# Altium schematic sheet ICM-20948.SchDoc
size A4
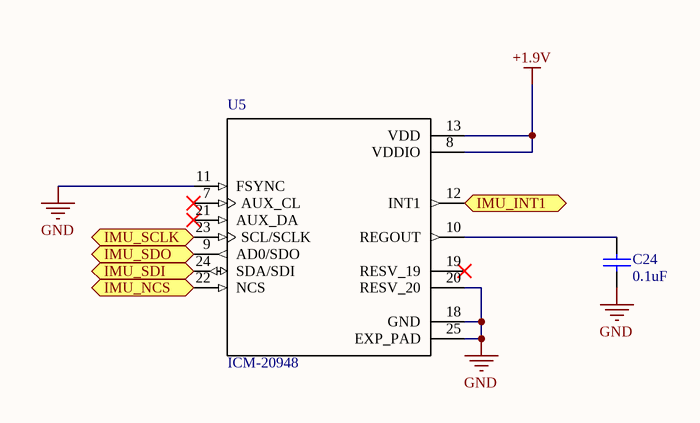
[diagram p0: ICM-20948.SchDoc]

## Parts
C24  value 0.1uF  [0201_Custom]
U5  ICM-20948  [ICM-20948]

## Ports
IMU_INT1 (out), IMU_NCS (in), IMU_SCLK (in), IMU_SDI (in), IMU_SDO (out)

## Nets
+1.9V: U5.8(VDDIO) U5.13(VDD)
GND: C24.2 U5.11(FSYNC) U5.18(GND) U5.20(RESV_20) U5.25(EXP_PAD)
IMU_INT1: U5.12(INT1) ; port IMU_INT1
IMU_NCS: U5.22(NCS) ; port IMU_NCS
IMU_SCLK: U5.23(SCL/SCLK) ; port IMU_SCLK
IMU_SDI: U5.24(SDA/SDI) ; port IMU_SDI
IMU_SDO: U5.9(AD0/SDO) ; port IMU_SDO
NetC24_1: C24.1 U5.10(REGOUT)

Not connected (* = marked no-connect by the designer): U5 7(AUX_CL)* 19(RESV_19)* 21(AUX_DA)*

## Library data of the parts
C24 = Cap Semi: Capacitor (Semiconductor SIM Model); Published: 8-Jun-2000; LatestRevisionDate: 29-May-2009; LatestRevisionNote: IPC-7351 Footprint Added.; PackageReference: C1206; Publisher: Altium Limited; PackageDescription: Chip Capacitor
U5 = ICM-20948: 9 Axis=3 Axis Gyro+3 Axis Accel+Compass. Pin For Pin With m; MF: TDK InvenSense; MP: ICM-20948; SnapEDA_Link: https://www.snapeda.com/parts/ICM-20948/TDK%20InvenSense/view-part/?ref=snap; Package: QFN-24 InvenSense; Digi-Key_Part_Number: 1428-1123-1-ND; Digi-Key_Purchase_URL: https://www.digikey.ca/product-detail/en/tdk-invensense/ICM-20948/1428-1123-1-ND/7062698?utm_source=snapeda&utm_medium=aggregator&utm_campaign=symbol; Value: *